# EAGLE design panel jack board (EAGLE 9.6.2)
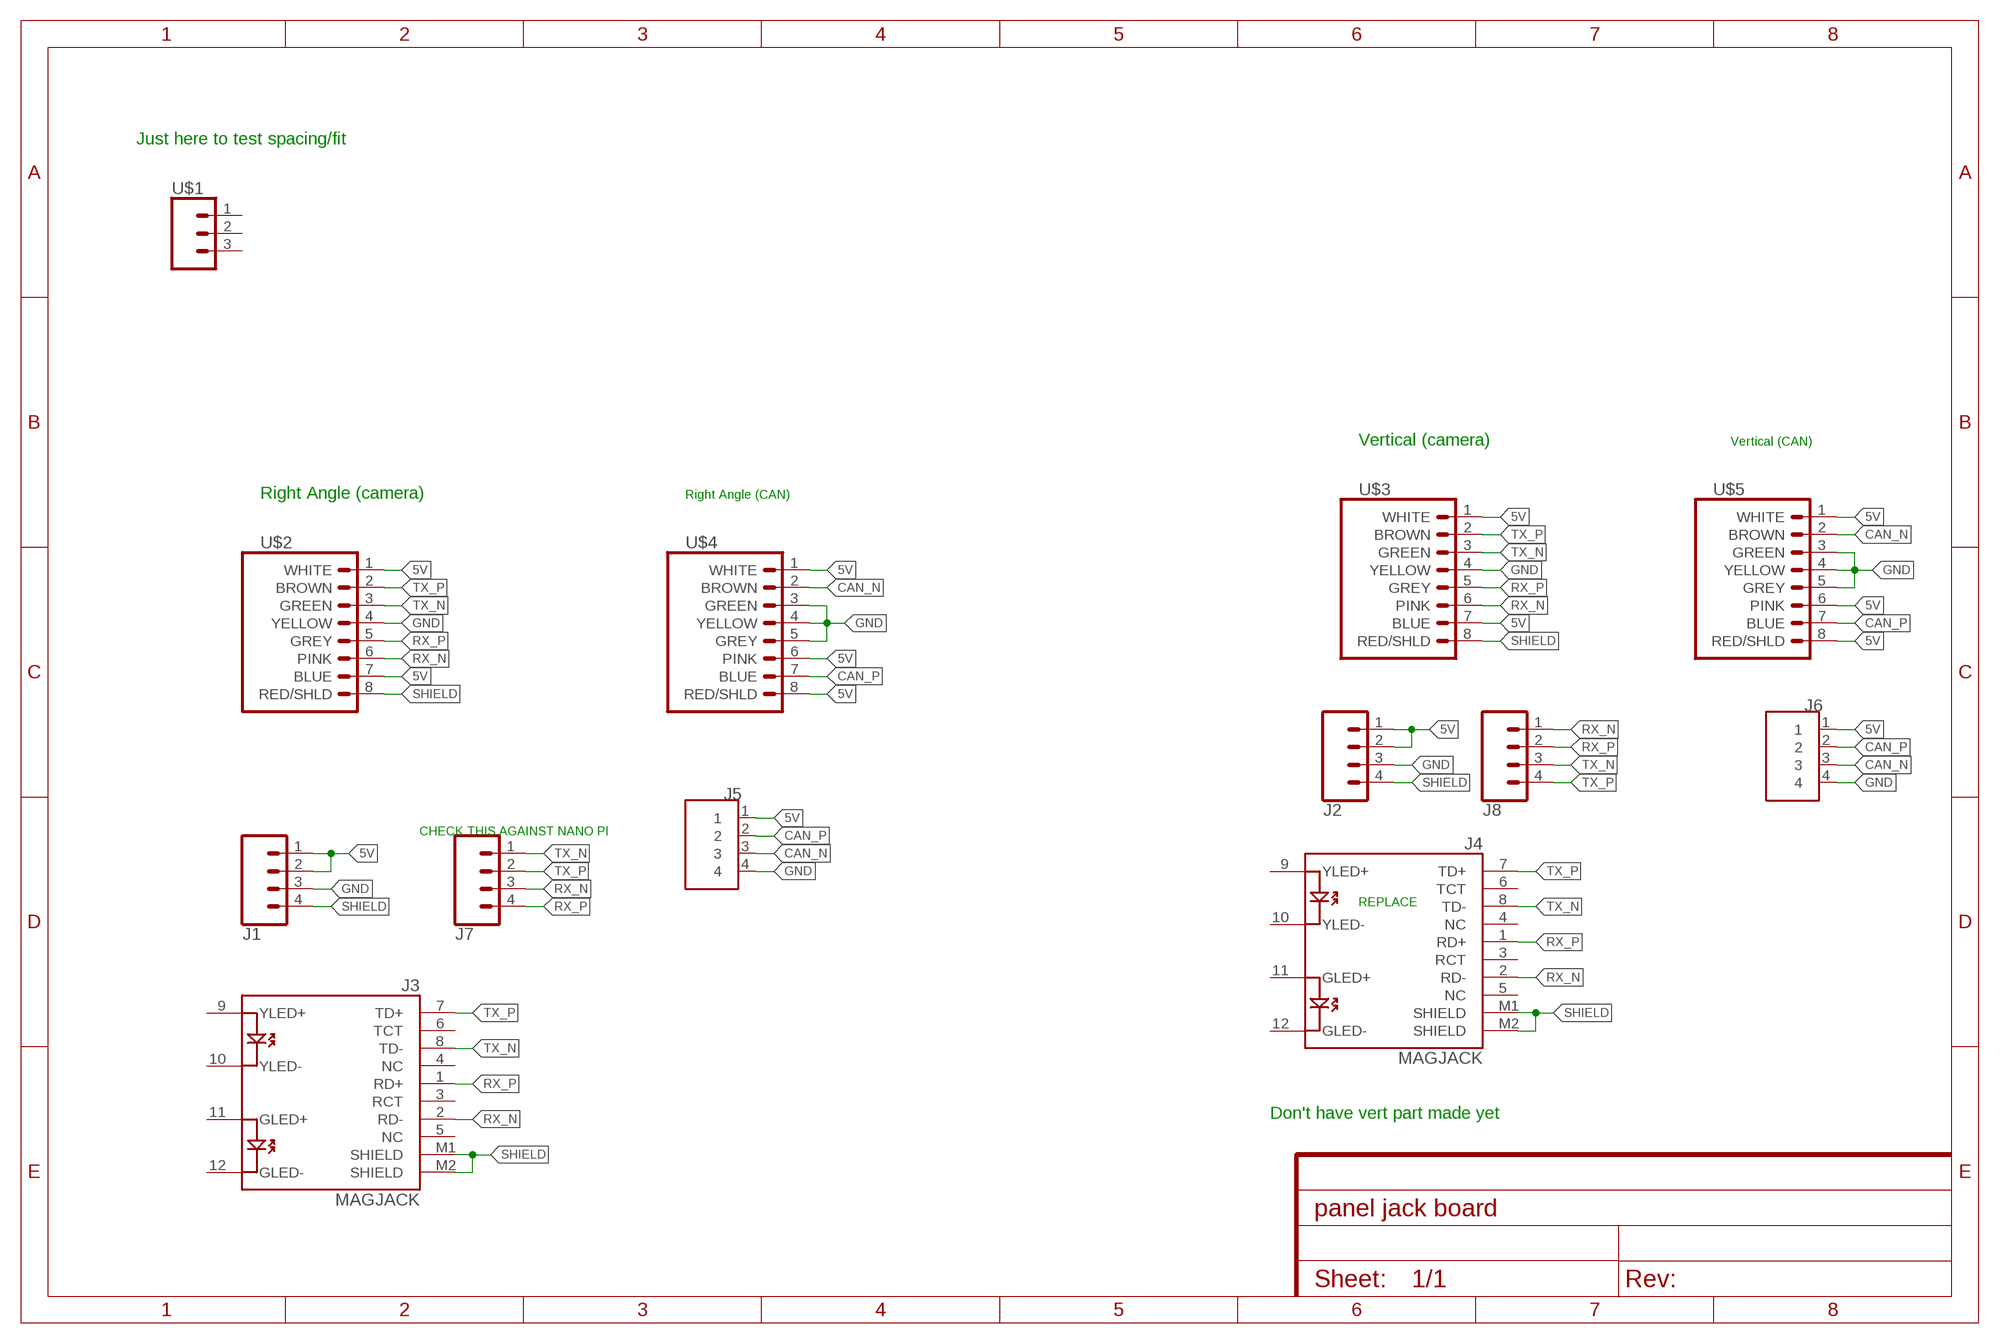
[diagram p0: schematic, sheet 1]

## Parts
J1  PXC-PTSM-04-V-1778573  [PXC-PTSM-04-V-1778573]
J2  PXC-PTSM-04-V-1778573  [PXC-PTSM-04-V-1778573]
J3  MAGJACK  [MAGJACK]
J4  MAGJACK  [MAGJACK]
J5  284512-4  [TE_284512-4]
J6  284512-4  [TE_284512-4]
J7  PXC-PTSM-04-RA-1778641  [PXC-PTSM-04-RA-1778641]
J8  PXC-PTSM-04-V-1778573  [PXC-PTSM-04-V-1778573]
U$1  BULGIN_BUC4000_3  [BULGIN_BUC4000_3]
U$2  BINDER_M12_RA_8  [BINDER_M12_RA_8]
U$3  BINDER_M12_PAR_8_DIP  [BINDER_M12_PAR_8_DIP]
U$4  BINDER_M12_RA_8  [BINDER_M12_RA_8]
U$5  BINDER_M12_PAR_8_DIP  [BINDER_M12_PAR_8_DIP]

## Nets
5V: J1.1 J1.2 J2.1 J2.2 J5.1 J6.1 U$2.1(WHITE) U$2.7(BLUE) U$3.1(WHITE) U$3.7(BLUE) U$4.1(WHITE) U$4.6(PINK) U$4.8(RED/SHLD) U$5.1(WHITE) U$5.6(PINK) U$5.8(RED/SHLD)
CAN_N [diff pair]: J5.3 J6.3 U$4.2(BROWN) U$5.2(BROWN)
CAN_P [diff pair]: J5.2 J6.2 U$4.7(BLUE) U$5.7(BLUE)
GND: J1.3 J2.3 J5.4 J6.4 U$2.4(YELLOW) U$3.4(YELLOW) U$4.3(GREEN) U$4.4(YELLOW) U$4.5(GREY) U$5.3(GREEN) U$5.4(YELLOW) U$5.5(GREY)
RX_N [diff pair]: J3.2(RD-) J4.2(RD-) J7.3 J8.1 U$2.6(PINK) U$3.6(PINK)
RX_P [diff pair]: J3.1(RD+) J4.1(RD+) J7.4 J8.2 U$2.5(GREY) U$3.5(GREY)
SHIELD: J1.4 J2.4 J3.M1(SHIELD) J3.M2(SHIELD) J4.M1(SHIELD) J4.M2(SHIELD) U$2.8(RED/SHLD) U$3.8(RED/SHLD)
TX_N [diff pair]: J3.8(TD-) J4.8(TD-) J7.1 J8.3 U$2.3(GREEN) U$3.3(GREEN)
TX_P [diff pair]: J3.7(TD+) J4.7(TD+) J7.2 J8.4 U$2.2(BROWN) U$3.2(BROWN)
Unconnected: J3.3(RCT) J3.4(NC) J3.5(NC) J3.6(TCT) J3.9(YLED+) J3.10(YLED-) J3.11(GLED+) J3.12(GLED-) J4.3(RCT) J4.4(NC) J4.5(NC) J4.6(TCT) J4.9(YLED+) J4.10(YLED-) J4.11(GLED+) J4.12(GLED-) U$1.1 U$1.2 U$1.3

## Notes on the sheet
- Just here to test spacing/fit
- Vertical (camera) | Vertical (CAN)
- Right Angle (camera) | Right Angle (CAN)
- CHECK THIS AGAINST NANO PI
- REPLACE
- Don't have vert part made yet

## Library data of the parts
J1 J2 J8 = Phoenix Contact PTSM-04-V-1778573:PXC-PTSM-04-V-1778573
J3 J4 = SparkFun-Connectors:MAGJACK: MAGJACK: RJ-45 with LEDs This is a single port, RJ45 ethernet jacks with built in transformer (magnetics), status LEDs, and shielding. Here is the connector we sell at SparkFun: RJ45 Ethernet MagJack-Compatible <https://www.sparkfun.com/products/8534> (PRT-08534) Datasheet <http://www.sparkfun.com/datasheets/Prototyping/MagJack.pdf> It is used on this SparkFun product: SparkFun RJ45 MagJack Breakout <https://www.sparkfun.com/products/13021> (BOB-13021); PROD_ID: CONN-09556; SF_ID: PRT-08534
J5 J6 = te 3.5m mm horiz 4 pin:284512-4; MANUFACTURER: TE; PARTREV: R; STANDARD: Manufacturer Recommendations
J7 = Phoenix Contact PTSM-04-V-1778573:PXC-PTSM-04-RA-1778641
U$1 = Panel Mounts Connectors:BULGIN_BUC4000_3: Bulgin PXP4013/03P/PC
U$2 U$4 = Panel Mounts Connectors:BINDER_M12_RA_8: Binder: 99-3481-202-08
U$3 U$5 = Panel Mounts Connectors:BINDER_M12_PAR_8_DIP: Binder: 86-0231-0000-00008

## Net classes
0 default: width 0.203 mm
1 diff pair: clearance 0.203 mm

## Board
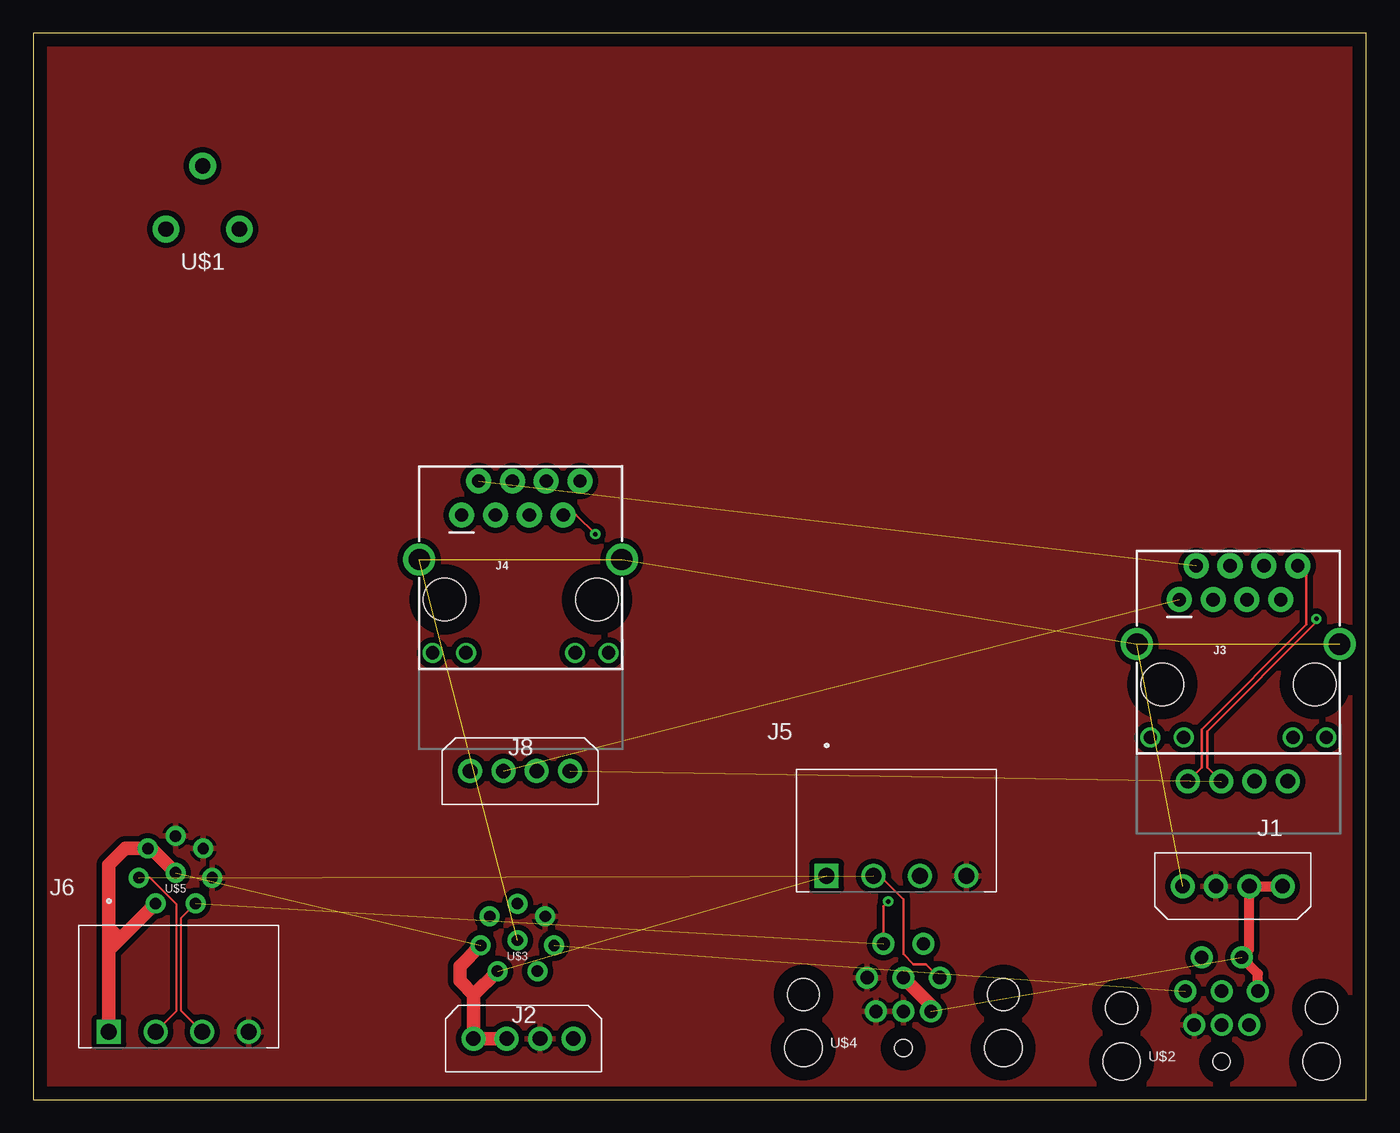
[diagram p1: board, top side]
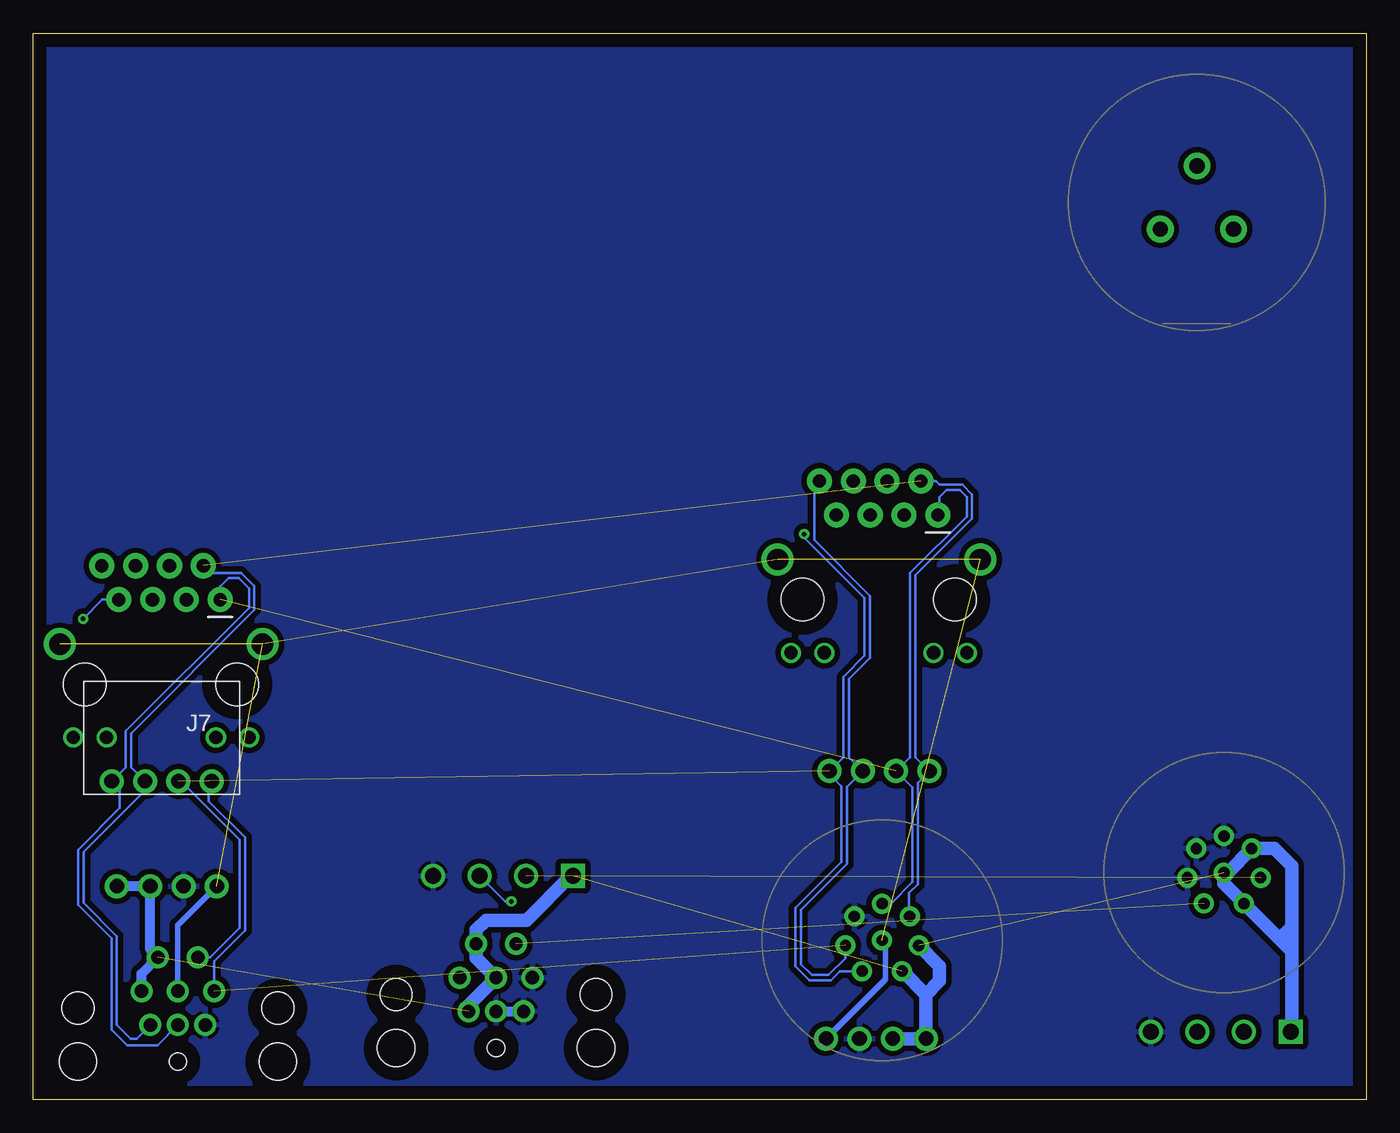
[diagram p2: board, bottom side, seen from below]

Size 100 x 80 mm. Coordinates in mm from the lower left corner, seen from the top.
Outline: 0,0 100,0 100,80 0,80 0,0
Copper layers (1*16): Top 0.035mm / dielectric 1.5mm / Bottom 0.035mm
Design rules "default": minimum track width 6mil, minimum drill 0.35mm, track to track 6mil, track to pad 6mil, pad to pad 6mil, via to via 6mil, smd to smd 6mil, copper to edge 40mil, drill to drill 6mil, minimum pad ring 10mil, minimum via ring 8mil, stop-mask expansion 4mil, vias tented up to drill 0mil, thermal gap 10mil

### Footprints (pad centres in the part's own frame; a part is rotated, then mirrored left to right if it is on the bottom)
PXC-PTSM-04-V-1778573 = drill 1.1 pad 1.8: 1 0,0; 2 2.5,0; 3 5,0; 4 7.5,0
MAGJACK = drill 1 pad 1.88: 1 3.175,17.445; 2 4.445,19.985; 3 5.715,17.445; 4 6.985,19.985; 5 8.255,17.445; 6 9.525,19.985; 7 10.795,17.445; 8 12.065,19.985 | drill 1 pad 1.27: 9 1,7.1; 10 3.5,7.1; 11 11.7,7.1; 12 14.2,7.1 | drill 1.6 pad 2.184: M1 0,14.1; M2 15.2,14.1 | hole 3.2: 1.905,11.095; 13.335,11.095
TE_284512-4 = drill 1.2 square: 1 -5.25,0 | drill 1.2: 2 -1.75,0; 3 1.75,0; 4 5.25,0
PXC-PTSM-04-RA-1778641 = drill 1.1 pad 1.8: 1 0,0; 2 2.5,0; 3 5,0; 4 7.5,0
BULGIN_BUC4000_3 = drill 1.15 pad 2: 1 0,2.75; 2 2.75,-2; 3 -2.75,-2
BINDER_M12_RA_8 = drill 1 pad 1.65: 1 1.5,3.81; 2 -1.5,3.81; 3 -2.725,1.27; 4 -2.065,-1.27; 5 0,-1.27; 6 2.065,-1.27; 7 2.725,1.27; 8 0,1.27 | hole 2.4: 7.5,0; -7.5,0 | hole 2.8: -7.5,-4; 7.5,-4 | hole 1.3: 0,-4
BINDER_M12_PAR_8_DIP = drill 0.85 pad 1.5: 1 -1.5,-2.31; 2 1.5,-2.31; 3 2.75,-0.38; 4 2.08,1.81; 5 0,2.75; 6 -2.08,1.81; 7 -2.75,-0.38; 8 0,0

### Placement (x,y rotation side)
J1  93.73,16 180 top
J2  33.02,4.57 0 top
J3  82.8,20.07 0 top
J4  28.96,26.42 0 top
J5  64.77,16.76 0 top
J6  10.92,5.08 0 top
J7  86.61,23.88 180 bottom
J8  32.77,24.64 0 top
U$1  12.7,67.31 0 top
U$2  89.15,6.86 0 top
U$3  36.32,11.94 0 top
U$4  65.28,7.87 0 top
U$5  10.67,17.02 0 top

### Tracks (layer width: path | path; a pad name or v marks a point on that pad's centre or on a via)
5V  (3 unrouted)
  Top 0.762: U$2.7 91.88,9.44 U$2.1 91.23,11.24 J1.2 J1.1
  Top 1.016: J6.1 5.67,11.21 | 5.67,11.21 6.5,12.04 | 6.5,12.04 U$5.1 | U$5.8 8.86,18.83 U$5.6 6.89,18.83 5.67,17.61 5.67,12.87 | 6.5,12.04 5.67,12.87 | 5.67,11.21 5.67,12.87 | J2.2 J2.1 33.02,7.83 33.04,7.85 | 33.04,7.85 U$3.1 | U$3.7 32,9.99 32,8.89 33.04,7.85 | U$4.8 67.34,7.08 U$4.6
  Bottom 0.762: U$2.7 91.88,9.44 U$2.1 91.23,11.24 J1.2 J1.1
  Bottom 1.016: 5.59,12.95 5.59,17.53 6.89,18.83 U$5.6 10.4,17.02 U$5.8 10.67,16.21 U$5.1 6.5,12.04 | 5.59,12.95 5.59,11.13 | J6.1 5.59,5.16 5.59,11.13 | 6.5,12.04 5.59,11.13 | 5.59,12.95 6.5,12.04 | J2.2 J2.1 33.02,7.87 | 33.02,7.87 34.77,9.63 U$3.1 | U$3.7 32,9.99 32,8.89 33.02,7.87 | U$4.6 67.34,7.08 U$4.8 66.78,10.64 U$4.1 66.78,12.72 66.04,13.46 62.99,13.46 59.69,16.76 J5.1
CAN_N  (via drill 0.35)  (1 unrouted)
  Top 0.152: J6.3 11.1,6.65 11.1,13.64 U$5.2
  Top 0.203: U$4.2 63.78,14.5 v64.14,14.86
  Bottom 0.203: v64.14,14.86 64.61,14.86 J5.3
CAN_P  (1 unrouted)
  Top 0.152: J6.2 10.74,6.65 10.74,14.66 8.76,16.64 U$5.7
  Top 0.203: U$4.7 66.99,10.16 66.04,10.16 65.28,10.92 65.28,15.01 63.53,16.76 J5.2
GND
  Bottom 0.762: U$4.5 U$4.4
  pour Top (isolate 0.406): -2.79,-2.03 -2.79,81.79 101.35,81.79 101.35,-2.03
  pour Bottom (isolate 0.406): 102.62,-3.05 102.62,80.77 -1.52,80.77 -1.52,-3.05
RX_N  (1 unrouted)
  Bottom 0.203: U$3.6 34.29,13.79 34.29,15.49 33.63,16.15 33.63,23.77 J8.1 33.81,25.68 33.81,39.34 29.57,43.59 29.57,45.38 30.31,46.13 32,46.13 32.28,46.4 J4.2 | U$2.6 92.23,4.57 92.71,4.57 93.73,5.59 93.73,12.26 96.23,14.77 96.23,18.57 91.61,23.19 J7.3 92.66,24.92 92.66,27.48 83.41,36.73 83.41,38.52 84.41,39.52 86.61,39.52 87.14,40.05 J3.2
RX_P  (1 unrouted)
  Bottom 0.203: U$3.5 35.67,14.69 34.04,16.32 34.04,23.41 J8.2 34.22,25.68 34.22,39.51 29.97,43.76 29.97,45.21 30.48,45.72 31.5,45.72 32,45.21 32,43.99 J4.1 | U$2.5 90.68,4.06 92.96,4.06 94.13,5.23 94.13,12.09 96.64,14.6 96.64,18.74 93.5,21.88 93.5,23.27 J7.4 93.07,24.92 93.07,27.65 83.82,36.9 83.82,38.35 84.58,39.12 85.34,39.12 85.98,38.48 J3.1
SHIELD  (5 unrouted)
  Bottom 0.406: U$3.8 36.07,11.68 36.07,9.02 J2.4 | U$2.8 89.15,13.07 J1.4
TX_N  (1 unrouted)
  Top 0.203: J7.1 87.66,24.92 87.66,27.78 95.5,35.63 95.5,39.42 J3.8
  Bottom 0.203: U$3.3 39.07,10.6 40.33,9.34 41.6,9.34 42.42,10.16 42.42,14.22 38.96,17.68 38.96,23.44 J8.3 38.81,25.68 38.81,31.55 37.22,33.14 37.22,37.79 41.4,41.98 41.4,46.02 J4.8 | U$2.3 86.43,10.38 84.1,12.71 84.1,19.65 86.83,22.39 86.83,23.66 J7.1
TX_P  (via drill 0.35)  (1 unrouted)
  Top 0.203: J4.7 40.72,43.86 v42.16,42.42 | J7.2 88.07,24.92 88.07,27.61 96.27,35.81 v96.27,36.07
  Bottom 0.203: U$3.2 39.47,9.63 40.16,8.93 41.77,8.93 42.82,9.99 42.82,14.39 39.37,17.85 39.37,23.49 40.27,24.38 J8.4 39.22,25.68 39.22,31.71 37.62,33.31 37.62,37.62 42.16,42.16 v42.16,42.42 | U$2.2 86.72,10.67 84.51,12.88 84.51,19.48 88.9,23.88 J7.2 | J3.7 94.82,37.51 v96.27,36.07